# EAGLE design VistaAir (EAGLE 7.7.0)
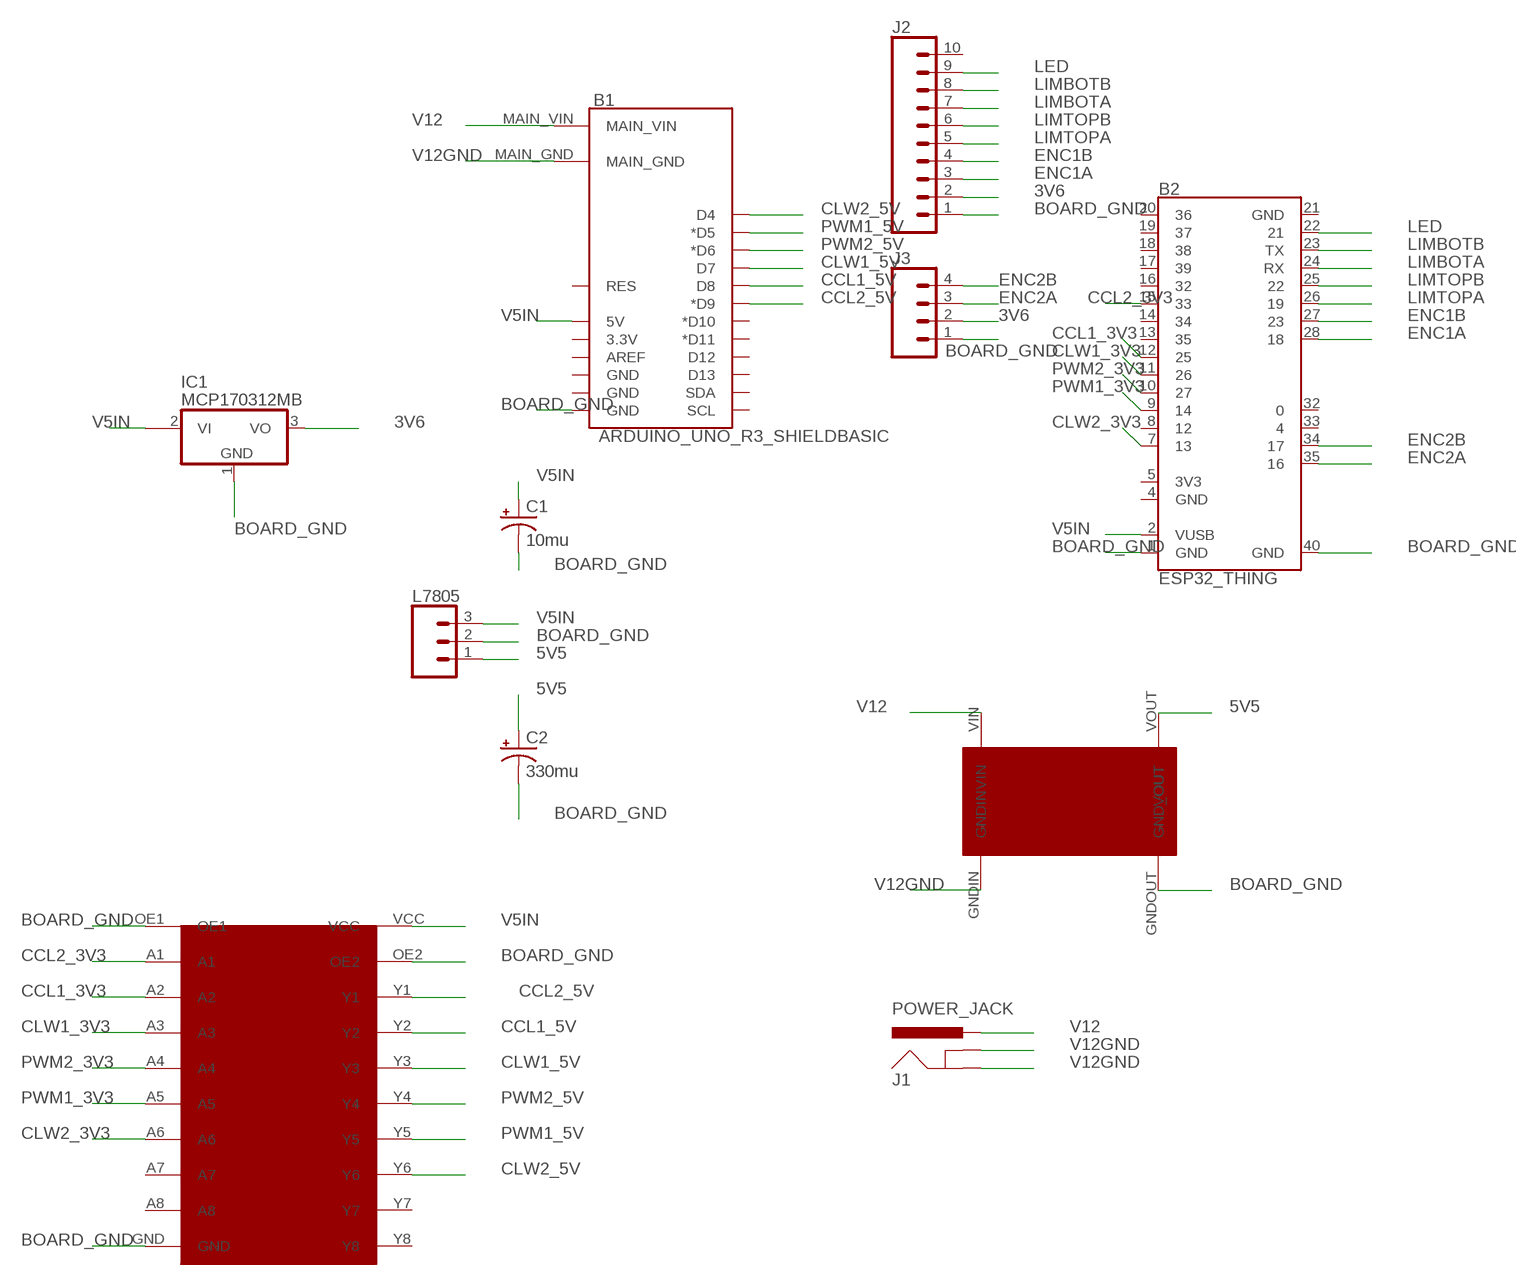
[diagram p0: schematic, sheet 1]

## Parts
B1  ARDUINO_UNO_R3_SHIELDBASIC  [UNO_R3_SHIELD]
B2  ESP32_THING  [ESP32_THING]
C1  10mu  CPOL-USTT2D5  [TT2D5]
C2  330mu  CPOL-USTT5D10  [TT5D10]
IC1  MCP170312MB  [SOT89]
J1  POWER_JACK  [POWER_JACK_PTH]
J2  CONN_10"  [1X10]
J3  CONN_04  [1X04]
L7805  CONN_03  [1X03]
U$1  SN74AHCT541_SOIC-20  [SN74AHCT541]
U$2  LM2596_STEPDOWN_MODULE  [LM2596_STEPDOWN_MODULE]

## Nets
3V6: IC1.3(VO) J2.2 J3.2
5V5 [power]: C2.+ L7805.1 U$2.VOUT
BOARD_GND [power]: B1.BOARD_GND(GND) B2.1(GND) B2.40(GND) C1.- C2.- IC1.1(GND) J2.1 J3.1 L7805.2 U$1.GND U$1.OE1 U$1.OE2 U$2.GNDOUT(GND_OUT)
CCL1_3V3: B2.12 U$1.A2
CCL1_5V: B1.D8 U$1.Y2
CCL2_3V3: B2.15 U$1.A1
CCL2_5V: B1.D9(*D9) U$1.Y1
CLW1_3V3: B2.11 U$1.A3
CLW1_5V: B1.D7 U$1.Y3
CLW2_3V3: B2.7 U$1.A6
CLW2_5V: B1.D4 U$1.Y6
ENC1A: B2.28 J2.3
ENC1B: B2.27 J2.4
ENC2A: B2.35 J3.3
ENC2B: B2.34 J3.4
LED: B2.22 J2.9
LIMBOTA: B2.24(RX) J2.7
LIMBOTB: B2.23(TX) J2.8
LIMTOPA: B2.26 J2.5
LIMTOPB: B2.25 J2.6
PWM1_3V3: B2.9 U$1.A5
PWM1_5V: B1.D5(*D5) U$1.Y5
PWM2_3V3: B2.10 U$1.A4
PWM2_5V: B1.D6(*D6) U$1.Y4
V5IN [power]: B1.5V B2.2(VUSB) C1.+ IC1.2@1(VI1) L7805.3 U$1.VCC
V12 [power]: B1.MAIN_VIN J1.PWR U$2.VIN
V12GND [power]: B1.MAIN_GND J1.GND J1.GNDBREAK U$2.GNDIN
Unconnected: B1.3.3V B1.5VIN(GND) B1.AREF B1.D10(*D10) B1.D11(*D11) B1.D12 B1.D13 B1.GND@2(GND) B1.RES B1.SCL B1.SDA B2.4(GND) B2.5(3V3) B2.8 B2.13 B2.14 B2.16 B2.17 B2.18 B2.19 B2.20 B2.21(GND) B2.32 B2.33 IC1.2(VI) J2.10 U$1.A7 U$1.A8 U$1.Y7 U$1.Y8

## Library data of the parts
B1 = kevins_parts:ARDUINO_UNO_R3_SHIELD: Arduino R3 Shield Footprint Shield form compatible with the Arduino Uno R3. SparkFun Products: MG2639 Cellular Shield <https://www.sparkfun.com/products/13120> MIDI Shield <https://www.sparkfun.com/products/12898> R3 Stackable Headers Kit <https://www.sparkfun.com/products/11417>
B2 = kevins_parts:ESP32_THING: SparkFun ESP32 Thing Board Pins, silkscreen, and logos matching the layout of the SparkFun ESP32 Thing <https://www.sparkfun.com/products/13907> Dimensions: 2.32" x 1.00"; SF_ID: DEV-13907
C1 C2 = adafruit:CPOL-US: POLARIZED CAPACITOR, American symbol
IC1 = linear:MCP1703*: 250 mA, 16V, Low Quiescent Current LDO Regulator Source: http://ww1.microchip.com/downloads/en/DeviceDoc/22049b.pdf
J1 = SparkFun-Connectors:POWER_JACK: Power Jack Connector This is the standard 5.5mm barrel jack for power. The PTH is the most common, proven, reliable, footprint. The Slot footprint only works if the mill layer is transmitted to the PCB fab house so be warned. Here are the connectors we sell at SparkFun: DC Barrel Power Jack/Connector <https://www.sparkfun.com/products/119> (PRT-00119) DC Barrel Power Jack/Connector (SMD) <https://www.sparkfun.com/products/12748> (PRT-12748) DC Barrel Jack Adapter - Breadboard Compatible <https://www.sparkfun.com/products/10811> (PRT-10811) It is used on this SparkFun product (and many, many others): SparkFun RedBoard - Programmed with Arduino <https://www.sparkfun.com/products/12757> (DEV-12757) Also, if you need a mating power supply or connector, please check these out: Wall Adapter Power Supply - 9VDC 650mA <https://www.sparkfun.com/products/298> (TOL-00298) DC Barrel Jack Adapter - Male <https://www.sparkfun.com/products/10287> (PRT-10287); PROD_ID: CONN-08197
J2 = SparkFun-Connectors:CONN_10: Multi connection point. Often used as Generic Header-pin footprint for 0.1 inch spaced/style header connections On any of the 0.1 inch spaced packages, you can populate with these: Break Away Headers - Straight <https://www.sparkfun.com/products/116> (PRT-00116) Break Away Male Headers - Right Angle <https://www.sparkfun.com/products/553> (PRT-00553) Female Headers <https://www.sparkfun.com/products/115> (PRT-00115) Break Away Headers - Machine Pin <https://www.sparkfun.com/products/117> (PRT-00117) Break Away Female Headers - Swiss Machine Pin <https://www.sparkfun.com/products/743> (PRT-00743) Arduino Stackable Header - 10 Pin <https://www.sparkfun.com/products/11376> (PRT-11376) For SCREWTERMINALS and SPRING TERMINALS visit here: Screw Terimnals on SparkFun.com <https://www.sparkfun.com/search/results?term=Screw+Terminals> (5mm/3.5mm/2.54mm spacing) This device is also useful as a general connection point to wire up your design to another part of your project. Our various solder wires solder well into these plated through hole pads. Hook-Up Wire - Assortment (Stranded, 22 AWG) <https://www.sparkfun.com/products/11375> (PRT-11375) Hook-Up Wire - Assortment (Solid Core, 22 AWG) <https://www.sparkfun.com/products/11367> (PRT-11367) View the entire wire category on our website here <https://www.sparkfun.com/categories/141> Special notes: Molex polarized connector foot print use with SKU : PRT-08231 with associated crimp pins and housings. 1MM SMD Version SKU: PRT-10208 NOTES ON THE VARIANTS LOCK and LOCK_LONGPADS... This footprint was designed to help hold the alignment of a through-hole component (i.e. 6-pin header) while soldering it into place. You may notice that each hole has been shifted either up or down by 0.005 of an inch from it's more standard position (which is a perfectly straight line). This slight alteration caused the pins (the squares in the middle) to touch the edges of the holes. Because they are alternating, it causes a "brace" to hold the component in place. 0.005 has proven to be the perfect amount of "off-center" position when using our standard breakaway headers. Although looks a little odd when you look at the bare footprint, once you have a header in there, the alteration is very hard to notice. Also,if you push a header all the way into place, it is covered up entirely on the bottom side.; PROD_ID: CONN-11563
J3 = SparkFun-Connectors:CONN_04: Multi connection point. Often used as Generic Header-pin footprint for 0.1 inch spaced/style header connections On any of the 0.1 inch spaced packages, you can populate with these: Break Away Headers - Straight <https://www.sparkfun.com/products/116> (PRT-00116) Break Away Male Headers - Right Angle <https://www.sparkfun.com/products/553> (PRT-00553) Female Headers <https://www.sparkfun.com/products/115> (PRT-00115) Break Away Headers - Machine Pin <https://www.sparkfun.com/products/117> (PRT-00117) Break Away Female Headers - Swiss Machine Pin <https://www.sparkfun.com/products/743> (PRT-00743) For SCREWTERMINALS and SPRING TERMINALS visit here: Screw Terimnals on SparkFun.com <https://www.sparkfun.com/search/results?term=Screw+Terminals> (5mm/3.5mm/2.54mm spacing) This device is also useful as a general connection point to wire up your design to another part of your project. Our various solder wires solder well into these plated through hole pads. Hook-Up Wire - Assortment (Stranded, 22 AWG) <https://www.sparkfun.com/products/11375> (PRT-11375) Hook-Up Wire - Assortment (Solid Core, 22 AWG) <https://www.sparkfun.com/products/11367> (PRT-11367) View the entire wire category on our website here <https://www.sparkfun.com/categories/141> Special notes: Molex polarized connector foot print use with SKU : PRT-08231 with associated crimp pins and housings. 1MM SMD Version SKU: PRT-10208; PROD_ID: CONN-09696
L7805 = SparkFun-Connectors:CONN_03: Multi connection point. Often used as Generic Header-pin footprint for 0.1 inch spaced/style header connections On any of the 0.1 inch spaced packages, you can populate with these: Break Away Headers - Straight <https://www.sparkfun.com/products/116> (PRT-00116) Break Away Male Headers - Right Angle <https://www.sparkfun.com/products/553> (PRT-00553) Female Headers <https://www.sparkfun.com/products/115> (PRT-00115) Break Away Headers - Machine Pin <https://www.sparkfun.com/products/117> (PRT-00117) Break Away Female Headers - Swiss Machine Pin <https://www.sparkfun.com/products/743> (PRT-00743) Stackable Header - 3 Pin (Female, 0.1") <https://www.sparkfun.com/products/13875> (PRT-13875) For SCREWTERMINALS and SPRING TERMINALS visit here: Screw Terimnals on SparkFun.com <https://www.sparkfun.com/search/results?term=Screw+Terminals> (5mm/3.5mm/2.54mm spacing) This device is also useful as a general connection point to wire up your design to another part of your project. Our various solder wires solder well into these plated through hole pads. Hook-Up Wire - Assortment (Stranded, 22 AWG) <https://www.sparkfun.com/products/11375> (PRT-11375) Hook-Up Wire - Assortment (Solid Core, 22 AWG) <https://www.sparkfun.com/products/11367> (PRT-11367) View the entire wire category on our website here <https://www.sparkfun.com/categories/141> Special notes: Molex polarized connector foot print use with SKU : PRT-08232 with associated crimp pins and housings.
U$1 = kevins_parts:SN74AHCT541_SOIC-20
U$2 = kevins_parts:LM2596_STEPDOWN_MODULE

## Net classes
0 default: width 0.508 mm, clearance 0.508 mm
1 power: width 1.27 mm, clearance 0.762 mm

## Board
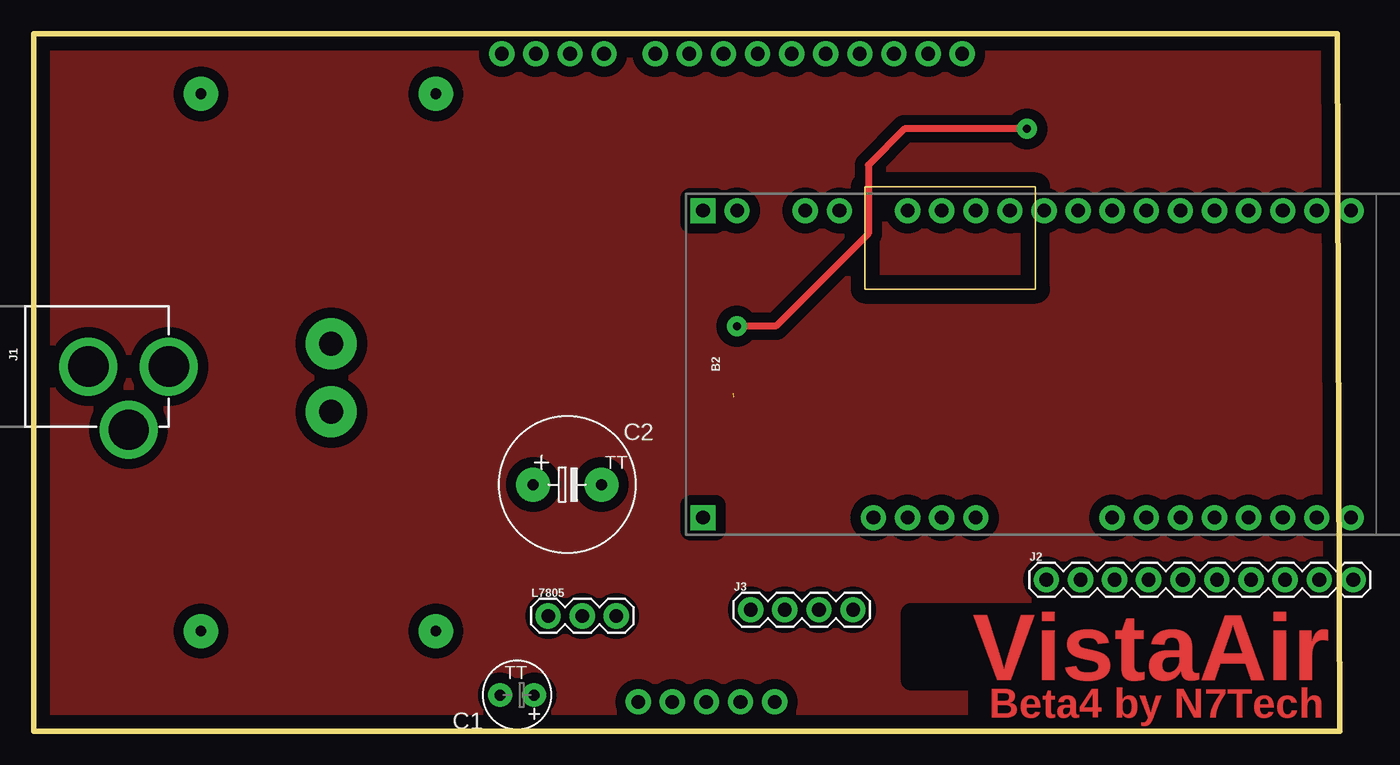
[diagram p1: board, top side]
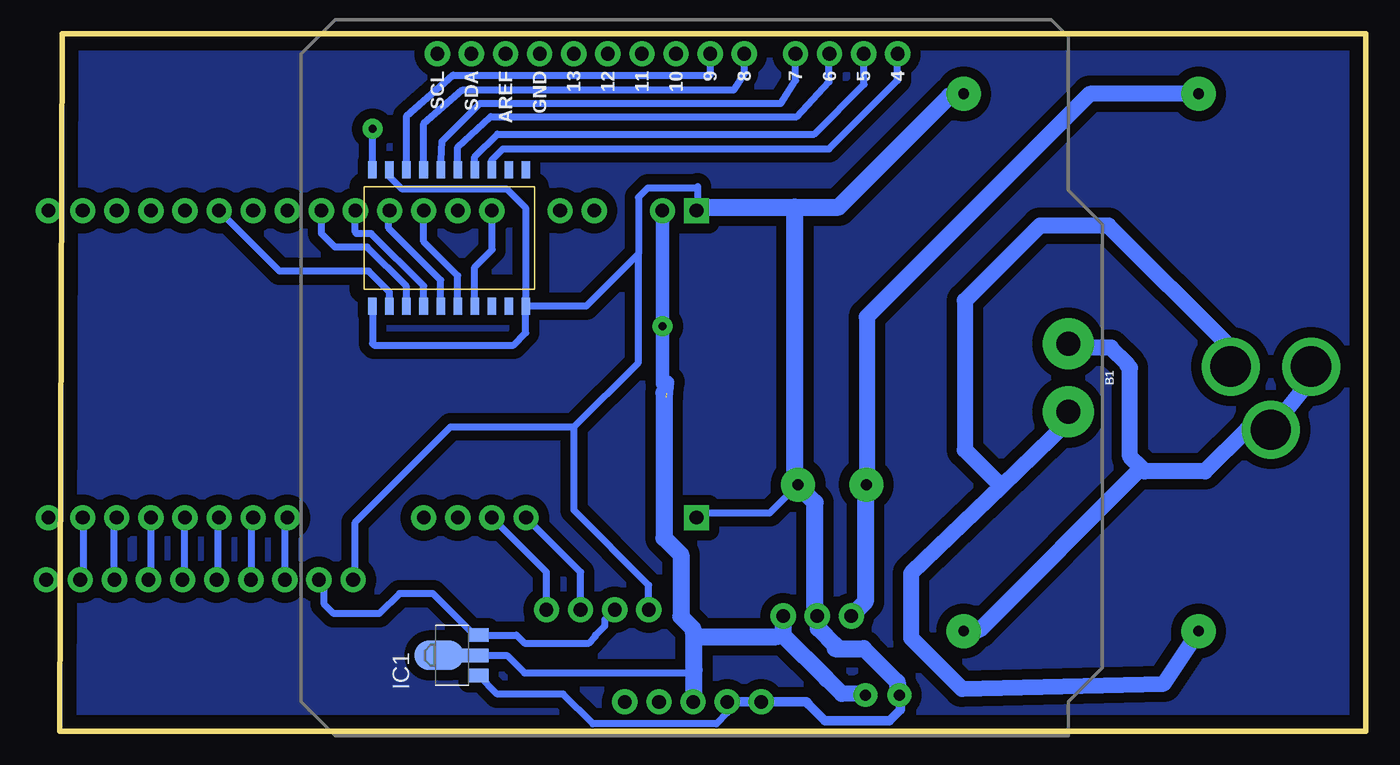
[diagram p2: board, bottom side, seen from below]

Size 97.28 x 51.94 mm. Coordinates in mm from the lower left corner, seen from the top.
Outline: 0.02,51.94 97.1,51.94 97.28,0 0,0 0.02,51.94
Copper layers (1*16): Top 0.035mm / dielectric 1.5mm / Bottom 0.035mm
Design rules "default": minimum track width 10mil, minimum drill 24mil, track to track 8mil, track to pad 8mil, pad to pad 8mil, via to via 8mil, smd to smd 8mil, copper to edge 40mil, drill to drill 8mil, minimum pad ring 10mil, minimum via ring 8mil, stop-mask expansion 4mil, vias tented up to drill 0mil, thermal gap 10mil

### Footprints (pad centres in the part's own frame; a part is rotated, then mirrored left to right if it is on the bottom)
UNO_R3_SHIELD = drill 1.016 pad 1.88: 3.3V 24.13,-2.54; 5V 24.13,0; 5VIN 24.13,5.08; AREF -24.13,-13.97; BOARD_GND 24.13,2.54; D4 -24.13,15.24; D5 -24.13,12.7; D6 -24.13,10.16; D7 -24.13,7.62; D8 -24.13,3.81; D9 -24.13,1.27; D10 -24.13,-1.27; D11 -24.13,-3.81; D12 -24.13,-6.35; D13 -24.13,-8.89; GND@2 -24.13,-11.43; RES 24.13,-5.08; SCL -24.13,-19.05; SDA -24.13,-16.51 | drill 1.778 pad 3.81: MAIN_GND -2.54,27.94; MAIN_VIN 2.54,27.94
ESP32_THING = drill 1.016 pad 1.88 square: 1 1.27,1.27; 40 24.13,1.27 | drill 1.016 pad 1.88: 2 1.27,3.81; 4 1.27,8.89; 5 1.27,11.43; 7 1.27,16.51; 8 1.27,19.05; 9 1.27,21.59; 10 1.27,24.13; 11 1.27,26.67; 12 1.27,29.21; 13 1.27,31.75; 14 1.27,34.29; 15 1.27,36.83; 16 1.27,39.37; 17 1.27,41.91; 18 1.27,44.45; 19 1.27,46.99; 20 1.27,49.53; 21 24.13,49.53; 22 24.13,46.99; 23 24.13,44.45; 24 24.13,41.91; 25 24.13,39.37; 26 24.13,36.83; 27 24.13,34.29; 28 24.13,31.75; 32 24.13,21.59; 33 24.13,19.05; 34 24.13,16.51; 35 24.13,13.97
TT2D5 = drill 0.813 pad 1.778: + -1.27,0; - 1.27,0
TT5D10 = drill 0.813 pad 2.54: + -2.54,0; - 2.54,0
SOT89 = smd 1 x 1.5: 1 -1.499,-1.981; 3 1.499,-1.981 | smd 1 x 2: 2 0,-1.727 | smd 2.2 x 3.7: 2@1 0,0.94
POWER_JACK_PTH = drill 2.997 pad 4.318: GND 0,7.7; GNDBREAK 4.7,10.7; PWR 0,13.7
1X10 = drill 1.016 pad 1.88: 1 0,0; 2 2.54,0; 3 5.08,0; 4 7.62,0; 5 10.16,0; 6 12.7,0; 7 15.24,0; 8 17.78,0; 9 20.32,0; 10 22.86,0
1X04 = drill 1.016 pad 1.88: 1 0,0; 2 2.54,0; 3 5.08,0; 4 7.62,0
1X03 = drill 1.016 pad 1.88: 1 0,0; 2 2.54,0; 3 5.08,0
SN74AHCT541 = smd 1.27 x 0.635: A1 -3.81,4.445; A2 -3.81,3.175; A3 -3.81,1.905; A4 -3.81,0.635; A5 -3.81,-0.635; A6 -3.81,-1.905; A7 -3.81,-3.175; A8 -3.81,-4.445; GND -3.81,-5.715; OE1 -3.81,5.715; OE2 6.35,4.445; VCC 6.35,5.715; Y1 6.35,3.175; Y2 6.35,1.905; Y3 6.35,0.635; Y4 6.35,-0.635; Y5 6.35,-1.905; Y6 6.35,-3.175; Y7 6.35,-4.445; Y8 6.35,-5.715
LM2596_STEPDOWN_MODULE = drill 0.8 pad 2.54: GNDIN 20,8.75; GNDOUT -20,8.75; VIN 20,-8.75; VOUT -20,-8.75

### Placement (x,y rotation side)
B1  50.11,26.31 270 bottom
B2  48.59,40.03 270 top
C1  36.02,2.69 180 top
C2  39.75,18.36 0 top
IC1  68.08,5.65 90 bottom
J1  -3.62,27.15 270 top
J2  75.44,11.28 0 top
J3  53.42,9.04 0 top
L7805  38.33,8.59 0 top
U$1  68.28,35.45 90 bottom
U$2  21.22,27.46 270 top

### Tracks (layer width: path | path; a pad name or v marks a point on that pad's centre or on a via)
3V6
  Bottom 0.51: J2.2 77.58,10.88 77.58,9.45 76.88,8.75 73.48,8.75 71.98,10.25 69.48,10.25 66.38,7.15 IC1.3 63.28,7.15 62.68,6.55 57.88,6.55 57.38,7.05 57.38,7.15 56.68,7.85 56.68,8.32 J3.2
5V5
  Bottom 1.2: U$2.VOUT 20.58,47.46 37.18,30.85 37.18,18.39 C2.+
  Bottom 1.27: L7805.1 38.28,8.65 37.28,9.65 37.28,18.28 C2.+
BOARD_GND
  Bottom 0.51: B1.BOARD_GND 47.57,1.36 48.38,0.55 57.58,0.55 59.78,2.75 64.7,2.75 IC1.1 | B2.1 49.78,38.84 49.78,40.55 49.88,40.45 53.48,40.45 54.18,39.75 54.18,35.55 | 75.28,11.15 75.28,15.55 68.18,22.65 58.98,22.65 | 58.98,22.65 54.18,27.45 54.18,35.55 | J3.1 53.42,10.89 58.98,16.45 58.98,22.65 | B2.40 49.86,16.07 49.68,16.25 44.4,16.25 C2.- | U$1.GND 62.57,38.94 63.98,40.35 71.78,40.35 72.68,41.25 72.68,41.76 U$1.OE2 | 54.18,35.55 58.08,31.65 U$1.GND | U$1.OE1 74,28.87 73.88,28.75 63.48,28.75 62.58,29.65 62.58,31.63 U$1.GND
  Bottom 0.7: B1.BOARD_GND 41.68,2.18 41.48,1.98 41.48,1.96 40.31,0.79 35.48,0.79 34.67,1.6 34.67,2.62 C1.-
  Bottom 0.762: 53.53,9.4 J3.1
  Bottom 1.2: 34.91,3.65 37.41,6.15
  Bottom 1.27: 42.53,39.03 49.16,39.03 B2.1 | 42.53,39.03 39.28,39.03 31.03,47.28 U$2.GNDOUT | 34.91,3.65 34.91,2.9 34.78,2.78 C1.- | 37.41,6.15 39.53,6.15 39.53,6.4 40.78,7.65 40.78,8.53 L7805.2 41.03,9.15 41.03,17.03 42.28,18.28 C2.- 42.53,18.9 42.53,39.03 | 75.28,11.15 J2.1
BOTTOM_FILL
  pour Bottom: -0.18,50.95 96.34,50.95 96.34,48.41 96.34,0.15 -0.18,0.15
CCL1_3V3
  Bottom 0.51: U$1.A2 71.46,33.13 74.38,36.05 76.78,36.05 77.78,37.05 77.78,38.74 B2.12
CCL1_5V
  Bottom 0.51: U$1.Y2 70.19,45.25 67.28,47.75 47.08,47.75 46.28,48.95 46.28,50.42 B1.D8
CCL2_3V3
  Bottom 0.51: U$1.A1 72.73,32.7 74.28,34.25 80.91,34.25 B2.15
CCL2_5V
  Bottom 0.51: U$1.Y1 71.46,45.78 67.98,48.85 48.84,48.85 B1.D9
CLW1_3V3
  Bottom 0.51: U$1.A3 70.19,33.16 74.08,37.05 75.18,37.05 75.28,37.15 75.28,38.74 B2.11
CLW1_5V
  Bottom 0.51: U$1.Y3 68.82,43.92 65.98,46.75 43.58,46.75 42.48,48.45 B1.D7
CLW2_3V3
  Bottom 0.51: U$1.A6 66.38,34.56 65.08,35.85 65.08,38.74 B2.7
CLW2_5V
  Bottom 0.51: U$1.Y6 65.11,42.53 64.28,43.35 39.98,43.35 34.88,48.45 B1.D4
ENC1A
  Bottom 0.508: J2.3 80.53,11.4 80.53,15.65 B2.28
ENC1B
  Bottom 0.508: J2.4 83.03,11.4 83.03,15.65 B2.27
ENC2A
  Bottom 0.51: J3.3 58.5,11.84 B2.35
ENC2B
  Bottom 0.51: J3.4 61.04,11.84 B2.34
LED
  Bottom 0.508: J2.9 95.53,11.4 95.53,15.65 B2.22
LIMBOTA
  Bottom 0.508: J2.7 90.53,11.4 90.53,15.65 B2.24
LIMBOTB
  Bottom 0.508: J2.8 93.28,11.4 93.28,15.65 B2.23
LIMTOPA
  Bottom 0.508: J2.5 85.53,11.4 85.53,15.65 B2.26
LIMTOPB
  Bottom 0.508: J2.6 88.03,11.4 88.03,15.65 B2.25
PWM1_3V3
  Bottom 0.51: U$1.A5 67.65,33.92 70.18,36.45 B2.9
PWM1_5V
  Bottom 0.51: U$1.Y5 66.38,42.76 64.68,44.45 41.08,44.45 37.38,48.15 37.38,50.41 B1.D5
PWM2_3V3
  Bottom 0.51: U$1.A4 68.92,33.59 72.78,37.45 72.78,38.7 B2.10
PWM2_5V
  Bottom 0.51: U$1.Y4 67.65,43.49 65.18,45.75 42.38,45.75 39.98,48.35 39.98,50.42 B1.D6
TOP_FILL
  pour Top: -0.18,50.95 96.34,50.95 96.34,0.15 -0.18,0.15
V5IN  (via drill 0.6 pad 1.5)  (1 unrouted)
  Top 0.51: v73.98,44.85 64.88,44.85 62.18,42.15 62.18,37.05 55.28,30.15 v52.38,30.15
  Bottom 0.51: 52.09,25.15 52.26,25.15 52.28,25.17 | IC1.2@1 63.98,5.65 62.68,4.35 50.23,4.35 50.03,4.55 | U$1.VCC 74,44.84 v73.98,44.85
  Bottom 1: 52.12,24.87 52.02,25.99 52.38,25.85 v52.38,30.15 52.38,38.74 B2.2
  Bottom 1.2: 37.41,2.78 39.03,2.78 40.16,3.9
  Bottom 1.27: 43.41,7.15 40.16,3.9 | 43.41,7.15 43.41,8.53 L7805.3 | 37.41,2.78 C1.+ | 50.03,7.03 44.03,7.03 43.41,7.15 | 50.03,7.03 50.03,4.55 50.03,2.4 B1.5V | 52.28,25.17 52.28,14.4 51.03,13.15 51.03,8.53 50.16,7.65 50.03,7.03
V12
  Bottom 1.2: 22.17,23.06 27.17,18.24 | 27.17,18.24 33.88,11.75 33.88,6.95 30.08,3.15 15.07,3.55 U$2.VIN | J1.PWR 10.08,28.55 19.18,37.65 24.28,37.65 29.88,32.05 29.88,20.96 27.17,18.24
  Bottom 1.27: B1.MAIN_VIN 22.28,23.65 22.17,23.06
V12GND
  Bottom 1.2: J1.GND 4.68,25.45 J1.GNDBREAK 8.88,22.45 11.98,19.35 16.48,19.35 16.73,19.6 | 16.73,19.6 17.58,20.45 17.58,27.05 17.78,27.25 17.78,27.35 18.98,28.55 21.87,28.55 B1.MAIN_GND | U$2.GNDIN 28.77,7.57 16.73,19.6

### Text on the board
Top: VistaAir | Beta4 by N7Tech